# Altium schematic sheet USB-C.SchDoc
size A; SheetNumber: 8; SheetTotal: 12
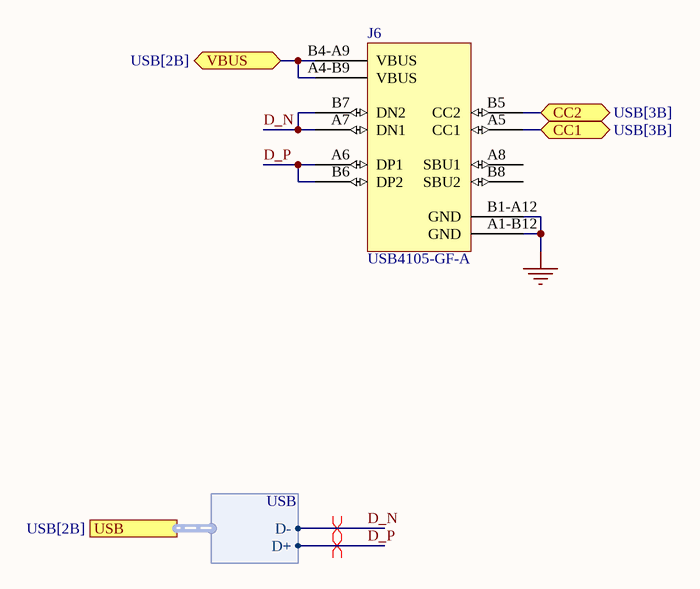
[diagram p0: USB-C.SchDoc]

## Parts
J6  USB4105-GF-A  [USB4105_GCT]

## Ports
CC1 (bidir, see USB[3B]), CC2 (bidir, see USB[3B]), USB (harness USB, see USB[2B]), VBUS (bidir, see USB[2B])

## Harnesses
USB: D-, D+

## Nets
GND: J6.A1-B12(GND) J6.B1-A12(GND)
CC1: J6.A5(CC1) ; port CC1
CC2: J6.B5(CC2) ; port CC2
D_N: J6.A7(DN1) J6.B7(DN2) ; port USB.D-
D_P: J6.A6(DP1) J6.B6(DP2) ; port USB.D+
VBUS: J6.A4-B9(VBUS) J6.B4-A9(VBUS) ; port VBUS

Not connected (* = marked no-connect by the designer): J6 A8(SBU1) B8(SBU2)

## Layout directives
differential pair: D_N, D_P

## Library data of the parts
J6 = CMP-022-000000-1: No Description Available; Mfr_Name: Global Connector Technology; Source: USB4105-GF-A.SchLib; Manufacturer_Part_Number: USB4105-GF-A; Design Item ID: USB4105-GF-A; Copyright: Copyright (C) 2023 Ultra Librarian. All rights reserved.; Digi-Key_Part_Number_2: 2073-USB4105-GF-ADKR-ND; Digi-Key_Part_Number_3: 2073-USB4105-GF-ATR-ND; Type: DEV; RefDes: RefDes; Digi-Key_Part_Number_1: 2073-USB4105-GF-ACT-ND